# Altium schematic sheet RK3576-SMC.SMARC_1 (0021.0 A0).SchDoc
size 420 x 297 mm; SheetNumber: 1; SheetTotal: 3; Scale: -; DocumentType: Схема электрическая принципиальная; DocumentGOSTLIt1: ㅤ; DocumentGOSTLIt2: ㅤ; DocumentGOSTLIt3: ㅤ; DocumentTypeShort: Э3; DocumentGOSTNote: 1 Элементы, отмеченные *), используются при трассировке печатной платы, в состав модуля не включаются.; DocumentInvertoryNumber: ㅤ
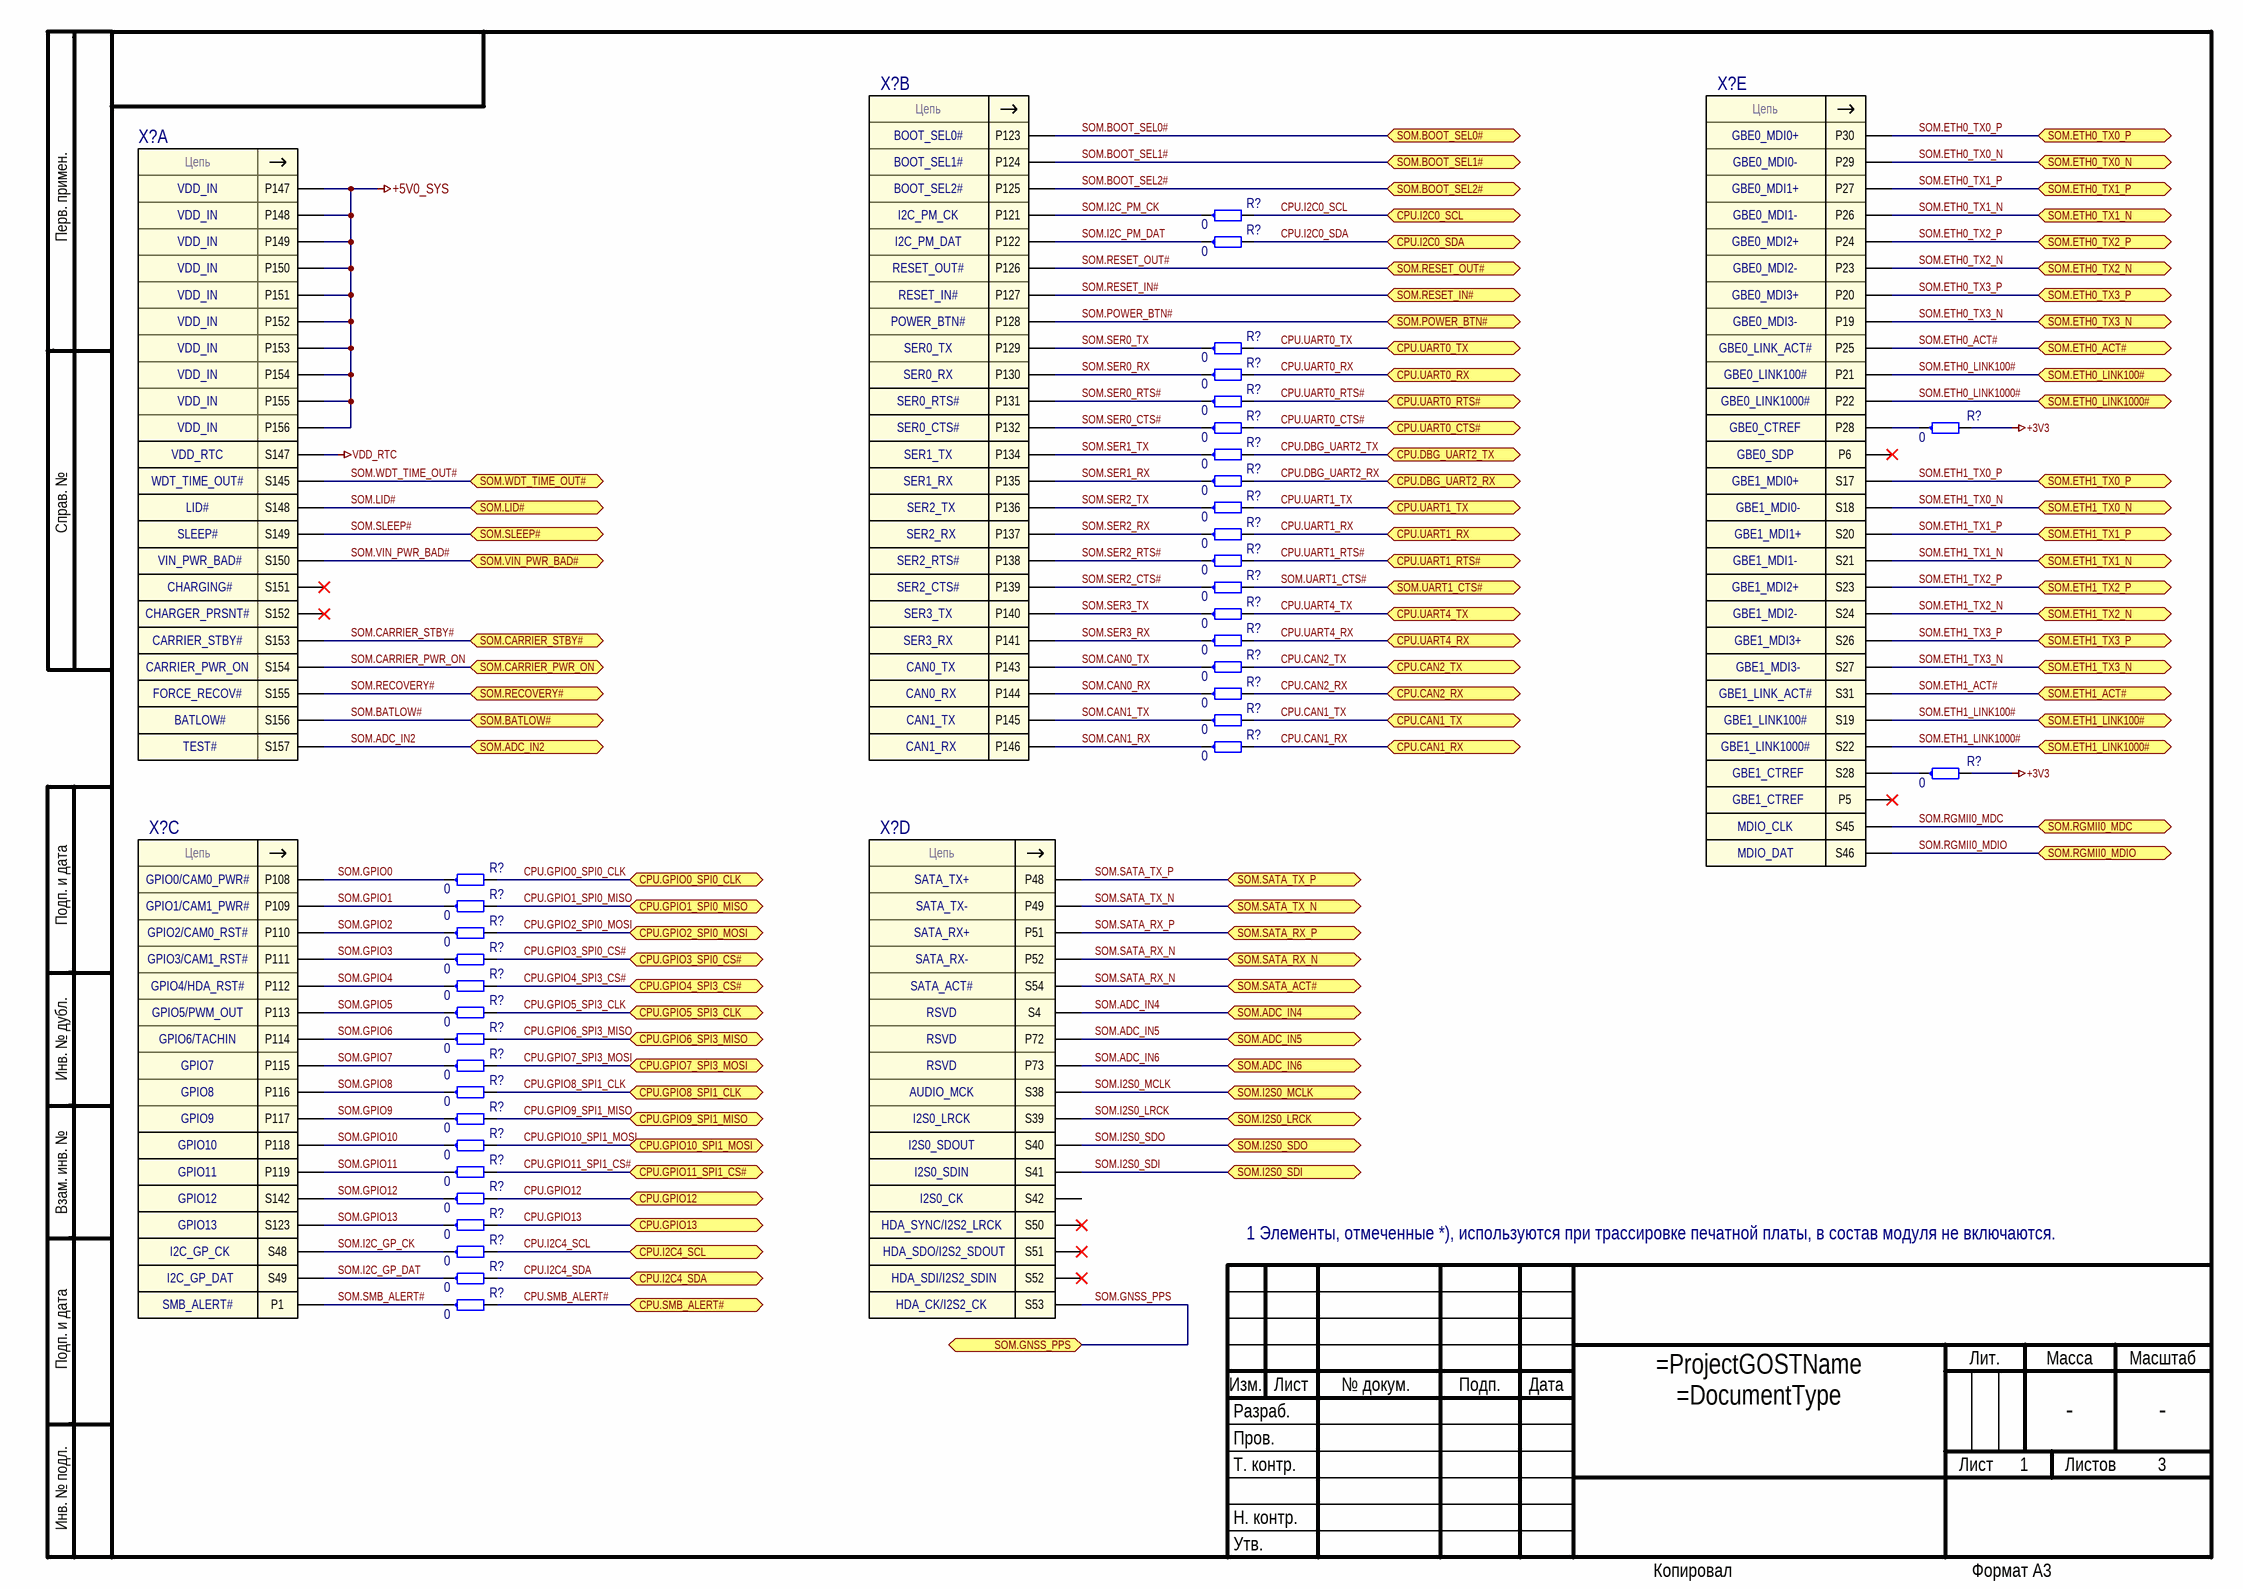
[diagram p0: RK3576-SMC.SMARC_1 (0021.0 A0).SchDoc]

## Parts
(Parts that share a designator on the sheet are numbered #1, #2 ... from top to bottom, then left to right.)
R?#1  0  [resc0603x26n]
R?#2  0  [resc0603x26n]
R?#3  0  [resc0603x26n]
R?#4  0  [resc0603x26n]
R?#5  0  [resc0603x26n]
R?#6  0  [resc0603x26n]
R?#7  0  [resc0603x26n]
R?#8  0  [resc0603x26n]
R?#9  0  [resc0603x26n]
R?#10  0  [resc0603x26n]
R?#11  0  [resc0603x26n]
R?#12  0  [resc0603x26n]
R?#13  0  [resc0603x26n]
R?#14  0  [resc0603x26n]
R?#15  0  [resc0603x26n]
R?#16  0  [resc0603x26n]
R?#17  0  [resc0603x26n]
R?#18  0  [resc0603x26n]
R?#19  0  [resc0603x26n]
R?#20  0  [resc0603x26n]
R?#21  0  [resc0603x26n]
R?#22  0  [resc0603x26n]
R?#23  0  [resc0603x26n]
R?#24  0  [resc0603x26n]
R?#25  0  [resc0603x26n]
R?#26  0  [resc0603x26n]
R?#27  0  [resc0603x26n]
R?#28  0  [resc0603x26n]
R?#29  0  [resc0603x26n]
R?#30  0  [resc0603x26n]
R?#31  0  [resc0603x26n]
R?#32  0  [resc0603x26n]
R?#33  0  [resc0603x26n]
R?#34  0  [resc0603x26n]
R?#35  0  [resc0603x26n]
R?#36  0  [resc0603x26n]
R?#37  0  [resc0603x26n]
X?#1  SMARC  [con_smarc]  (value not drawn)  (part B of 13)
X?#2  SMARC  [con_smarc]  (value not drawn)  (part E of 13)
X?#3  SMARC  [con_smarc]  (value not drawn)  (part A of 13)
X?#4  SMARC  [con_smarc]  (value not drawn)  (part C of 13)
X?#5  SMARC  [con_smarc]  (value not drawn)  (part D of 13)

## Ports
CPU.CAN1_RX (bidir), CPU.CAN1_TX (bidir), CPU.CAN2_RX (bidir), CPU.CAN2_TX (bidir), CPU.DBG_UART2_RX (bidir), CPU.DBG_UART2_TX (bidir), CPU.GPIO0_SPI0_CLK (bidir), CPU.GPIO1_SPI0_MISO (bidir), CPU.GPIO2_SPI0_MOSI (bidir), CPU.GPIO3_SPI0_CS# (bidir), CPU.GPIO4_SPI3_CS# (bidir), CPU.GPIO5_SPI3_CLK (bidir), CPU.GPIO6_SPI3_MISO (bidir), CPU.GPIO7_SPI3_MOSI (bidir), CPU.GPIO8_SPI1_CLK (bidir), CPU.GPIO9_SPI1_MISO (bidir), CPU.GPIO10_SPI1_MOSI (bidir), CPU.GPIO11_SPI1_CS# (bidir), CPU.GPIO12 (bidir), CPU.GPIO13 (bidir), CPU.I2C0_SCL (bidir), CPU.I2C0_SDA (bidir), CPU.I2C4_SCL (bidir), CPU.I2C4_SDA (bidir), CPU.SMB_ALERT# (bidir), CPU.UART0_CTS# (bidir), CPU.UART0_RTS# (bidir), CPU.UART0_RX (bidir), CPU.UART0_TX (bidir), CPU.UART1_RTS# (bidir), CPU.UART1_RX (bidir), CPU.UART1_TX (bidir), CPU.UART4_RX (bidir), CPU.UART4_TX (bidir), SOM.ADC_IN2 (bidir), SOM.ADC_IN4 (bidir), SOM.ADC_IN5 (bidir), SOM.ADC_IN6 (bidir), SOM.BATLOW# (bidir), SOM.BOOT_SEL0# (bidir), SOM.BOOT_SEL1# (bidir), SOM.BOOT_SEL2# (bidir), SOM.CARRIER_PWR_ON (bidir), SOM.CARRIER_STBY# (bidir), SOM.ETH0_ACT# (bidir), SOM.ETH0_LINK100# (bidir), SOM.ETH0_LINK1000# (bidir), SOM.ETH0_TX0_N (bidir), SOM.ETH0_TX0_P (bidir), SOM.ETH0_TX1_N (bidir), SOM.ETH0_TX1_P (bidir), SOM.ETH0_TX2_N (bidir), SOM.ETH0_TX2_P (bidir), SOM.ETH0_TX3_N (bidir), SOM.ETH0_TX3_P (bidir), SOM.ETH1_ACT# (bidir), SOM.ETH1_LINK100# (bidir), SOM.ETH1_LINK1000# (bidir), SOM.ETH1_TX0_N (bidir), SOM.ETH1_TX0_P (bidir), SOM.ETH1_TX1_N (bidir), SOM.ETH1_TX1_P (bidir), SOM.ETH1_TX2_N (bidir), SOM.ETH1_TX2_P (bidir), SOM.ETH1_TX3_N (bidir), SOM.ETH1_TX3_P (bidir), SOM.GNSS_PPS (bidir), SOM.I2S0_LRCK (bidir), SOM.I2S0_MCLK (bidir), SOM.I2S0_SDI (bidir), SOM.I2S0_SDO (bidir), SOM.LID# (bidir), SOM.POWER_BTN# (bidir), SOM.RECOVERY# (bidir), SOM.RESET_IN# (bidir), SOM.RESET_OUT# (bidir), SOM.RGMII0_MDC (bidir), SOM.RGMII0_MDIO (bidir), SOM.SATA_ACT# (bidir), SOM.SATA_RX_N (bidir), SOM.SATA_RX_P (bidir), SOM.SATA_TX_N (bidir), SOM.SATA_TX_P (bidir), SOM.SLEEP# (bidir), SOM.UART1_CTS# (bidir), SOM.VIN_PWR_BAD# (bidir), SOM.WDT_TIME_OUT# (bidir)

## Nets
+3V3: R?#7.2 R?#20.2
+5V0_SYS: X?#3.P147 X?#3.P148 X?#3.P149 X?#3.P150 X?#3.P151 X?#3.P152 X?#3.P153 X?#3.P154 X?#3.P155 X?#3.P156
VDD_RTC: X?#3.S147
CPU.CAN1_RX: R?#19.2 ; port CPU.CAN1_RX
CPU.CAN1_TX: R?#18.2 ; port CPU.CAN1_TX
CPU.CAN2_RX: R?#17.2 ; port CPU.CAN2_RX
CPU.CAN2_TX: R?#16.2 ; port CPU.CAN2_TX
CPU.DBG_UART2_RX: R?#9.2 ; port CPU.DBG_UART2_RX
CPU.DBG_UART2_TX: R?#8.2 ; port CPU.DBG_UART2_TX
CPU.GPIO0_SPI0_CLK: R?#21.2 ; port CPU.GPIO0_SPI0_CLK
CPU.GPIO1_SPI0_MISO: R?#22.2 ; port CPU.GPIO1_SPI0_MISO
CPU.GPIO2_SPI0_MOSI: R?#23.2 ; port CPU.GPIO2_SPI0_MOSI
CPU.GPIO3_SPI0_CS#: R?#24.2 ; port CPU.GPIO3_SPI0_CS#
CPU.GPIO4_SPI3_CS#: R?#25.2 ; port CPU.GPIO4_SPI3_CS#
CPU.GPIO5_SPI3_CLK: R?#26.2 ; port CPU.GPIO5_SPI3_CLK
CPU.GPIO6_SPI3_MISO: R?#27.2 ; port CPU.GPIO6_SPI3_MISO
CPU.GPIO7_SPI3_MOSI: R?#28.2 ; port CPU.GPIO7_SPI3_MOSI
CPU.GPIO8_SPI1_CLK: R?#29.2 ; port CPU.GPIO8_SPI1_CLK
CPU.GPIO9_SPI1_MISO: R?#30.2 ; port CPU.GPIO9_SPI1_MISO
CPU.GPIO10_SPI1_MOSI: R?#31.2 ; port CPU.GPIO10_SPI1_MOSI
CPU.GPIO11_SPI1_CS#: R?#32.2 ; port CPU.GPIO11_SPI1_CS#
CPU.GPIO12: R?#33.2 ; port CPU.GPIO12
CPU.GPIO13: R?#34.2 ; port CPU.GPIO13
CPU.I2C0_SCL: R?#1.2 ; port CPU.I2C0_SCL
CPU.I2C0_SDA: R?#2.2 ; port CPU.I2C0_SDA
CPU.I2C4_SCL: R?#35.2 ; port CPU.I2C4_SCL
CPU.I2C4_SDA: R?#36.2 ; port CPU.I2C4_SDA
CPU.SMB_ALERT#: R?#37.2 ; port CPU.SMB_ALERT#
CPU.UART0_CTS#: R?#6.2 ; port CPU.UART0_CTS#
CPU.UART0_RTS#: R?#5.2 ; port CPU.UART0_RTS#
CPU.UART0_RX: R?#4.2 ; port CPU.UART0_RX
CPU.UART0_TX: R?#3.2 ; port CPU.UART0_TX
CPU.UART1_RTS#: R?#12.2 ; port CPU.UART1_RTS#
CPU.UART1_RX: R?#11.2 ; port CPU.UART1_RX
CPU.UART1_TX: R?#10.2 ; port CPU.UART1_TX
CPU.UART4_RX: R?#15.2 ; port CPU.UART4_RX
CPU.UART4_TX: R?#14.2 ; port CPU.UART4_TX
SOM.ADC_IN2: X?#3.S157 ; port SOM.ADC_IN2
SOM.ADC_IN4: X?#5.S4 ; port SOM.ADC_IN4
SOM.ADC_IN5: X?#5.P72 ; port SOM.ADC_IN5
SOM.ADC_IN6: X?#5.P73 ; port SOM.ADC_IN6
SOM.BATLOW#: X?#3.S156 ; port SOM.BATLOW#
SOM.BOOT_SEL0#: X?#1.P123 ; port SOM.BOOT_SEL0#
SOM.BOOT_SEL1#: X?#1.P124 ; port SOM.BOOT_SEL1#
SOM.BOOT_SEL2#: X?#1.P125 ; port SOM.BOOT_SEL2#
SOM.CAN0_RX: R?#17.1 X?#1.P144
SOM.CAN0_TX: R?#16.1 X?#1.P143
SOM.CAN1_RX: R?#19.1 X?#1.P146
SOM.CAN1_TX: R?#18.1 X?#1.P145
SOM.CARRIER_PWR_ON: X?#3.S154 ; port SOM.CARRIER_PWR_ON
SOM.CARRIER_STBY#: X?#3.S153 ; port SOM.CARRIER_STBY#
SOM.ETH0_ACT#: X?#2.P25 ; port SOM.ETH0_ACT#
SOM.ETH0_LINK100#: X?#2.P21 ; port SOM.ETH0_LINK100#
SOM.ETH0_LINK1000#: X?#2.P22 ; port SOM.ETH0_LINK1000#
SOM.ETH0_TX0_N: X?#2.P29 ; port SOM.ETH0_TX0_N
SOM.ETH0_TX0_P: X?#2.P30 ; port SOM.ETH0_TX0_P
SOM.ETH0_TX1_N: X?#2.P26 ; port SOM.ETH0_TX1_N
SOM.ETH0_TX1_P: X?#2.P27 ; port SOM.ETH0_TX1_P
SOM.ETH0_TX2_N: X?#2.P23 ; port SOM.ETH0_TX2_N
SOM.ETH0_TX2_P: X?#2.P24 ; port SOM.ETH0_TX2_P
SOM.ETH0_TX3_N: X?#2.P19 ; port SOM.ETH0_TX3_N
SOM.ETH0_TX3_P: X?#2.P20 ; port SOM.ETH0_TX3_P
SOM.ETH1_ACT#: X?#2.S31 ; port SOM.ETH1_ACT#
SOM.ETH1_LINK100#: X?#2.S19 ; port SOM.ETH1_LINK100#
SOM.ETH1_LINK1000#: X?#2.S22 ; port SOM.ETH1_LINK1000#
SOM.ETH1_TX0_N: X?#2.S18 ; port SOM.ETH1_TX0_N
SOM.ETH1_TX0_P: X?#2.S17 ; port SOM.ETH1_TX0_P
SOM.ETH1_TX1_N: X?#2.S21 ; port SOM.ETH1_TX1_N
SOM.ETH1_TX1_P: X?#2.S20 ; port SOM.ETH1_TX1_P
SOM.ETH1_TX2_N: X?#2.S24 ; port SOM.ETH1_TX2_N
SOM.ETH1_TX2_P: X?#2.S23 ; port SOM.ETH1_TX2_P
SOM.ETH1_TX3_N: X?#2.S27 ; port SOM.ETH1_TX3_N
SOM.ETH1_TX3_P: X?#2.S26 ; port SOM.ETH1_TX3_P
SOM.GNSS_PPS: X?#5.S53 ; port SOM.GNSS_PPS
SOM.GPIO0: R?#21.1 X?#4.P108
SOM.GPIO1: R?#22.1 X?#4.P109
SOM.GPIO2: R?#23.1 X?#4.P110
SOM.GPIO3: R?#24.1 X?#4.P111
SOM.GPIO4: R?#25.1 X?#4.P112
SOM.GPIO5: R?#26.1 X?#4.P113
SOM.GPIO6: R?#27.1 X?#4.P114
SOM.GPIO7: R?#28.1 X?#4.P115
SOM.GPIO8: R?#29.1 X?#4.P116
SOM.GPIO9: R?#30.1 X?#4.P117
SOM.GPIO10: R?#31.1 X?#4.P118
SOM.GPIO11: R?#32.1 X?#4.P119
SOM.GPIO12: R?#33.1 X?#4.S142
SOM.GPIO13: R?#34.1 X?#4.S123
SOM.I2C_GP_CK: R?#35.1 X?#4.S48
SOM.I2C_GP_DAT: R?#36.1 X?#4.S49
SOM.I2C_PM_CK: R?#1.1 X?#1.P121
SOM.I2C_PM_DAT: R?#2.1 X?#1.P122
SOM.I2S0_LRCK: X?#5.S39 ; port SOM.I2S0_LRCK
SOM.I2S0_MCLK: X?#5.S38 ; port SOM.I2S0_MCLK
SOM.I2S0_SDI: X?#5.S41 ; port SOM.I2S0_SDI
SOM.I2S0_SDO: X?#5.S40 ; port SOM.I2S0_SDO
SOM.LID#: X?#3.S148 ; port SOM.LID#
SOM.POWER_BTN#: X?#1.P128 ; port SOM.POWER_BTN#
SOM.RECOVERY#: X?#3.S155 ; port SOM.RECOVERY#
SOM.RESET_IN#: X?#1.P127 ; port SOM.RESET_IN#
SOM.RESET_OUT#: X?#1.P126 ; port SOM.RESET_OUT#
SOM.RGMII0_MDC: X?#2.S45 ; port SOM.RGMII0_MDC
SOM.RGMII0_MDIO: X?#2.S46 ; port SOM.RGMII0_MDIO
SOM.SATA_RX_N: X?#5.P52 X?#5.S54 ; port SOM.SATA_RX_N, port SOM.SATA_ACT#
SOM.SATA_RX_P: X?#5.P51 ; port SOM.SATA_RX_P
SOM.SATA_TX_N: X?#5.P49 ; port SOM.SATA_TX_N
SOM.SATA_TX_P: X?#5.P48 ; port SOM.SATA_TX_P
SOM.SER0_CTS#: R?#6.1 X?#1.P132
SOM.SER0_RTS#: R?#5.1 X?#1.P131
SOM.SER0_RX: R?#4.1 X?#1.P130
SOM.SER0_TX: R?#3.1 X?#1.P129
SOM.SER1_RX: R?#9.1 X?#1.P135
SOM.SER1_TX: R?#8.1 X?#1.P134
SOM.SER2_CTS#: R?#13.1 X?#1.P139
SOM.SER2_RTS#: R?#12.1 X?#1.P138
SOM.SER2_RX: R?#11.1 X?#1.P137
SOM.SER2_TX: R?#10.1 X?#1.P136
SOM.SER3_RX: R?#15.1 X?#1.P141
SOM.SER3_TX: R?#14.1 X?#1.P140
SOM.SLEEP#: X?#3.S149 ; port SOM.SLEEP#
SOM.SMB_ALERT#: R?#37.1 X?#4.P1
SOM.UART1_CTS#: R?#13.2 ; port SOM.UART1_CTS#
SOM.VIN_PWR_BAD#: X?#3.S150 ; port SOM.VIN_PWR_BAD#
SOM.WDT_TIME_OUT#: X?#3.S145 ; port SOM.WDT_TIME_OUT#
NetR?#7_1: R?#7.1 X?#2.P28
NetR?#20_1: R?#20.1 X?#2.S28

Not connected (* = marked no-connect by the designer): X?#2 P5* P6*; X?#3 S151* S152*; X?#5 S42 S50* S51* S52*

## Notes on the sheet
- Перв. примен.
- Справ. №
- Подп. и дата
- Инв. № дубл.
- Взам. инв. №
- Разраб.
- Изм.
- Лист
- № докум.
- Подп.
- Дата
- Лит.
- Масса
- Масштаб
- Пров.
- Т. контр.
- -
- Листов
- Инв. № подл.
- Утв.
- Н. контр.
- Копировал
- Формат А3
- (in symbol SMARC, part A) Цепь; VDD_IN; VDD_RTC; WDT_TIME_OUT#; LID#; SLEEP#; VIN_PWR_BAD#; CHARGING#; CHARGER_PRSNT#; CARRIER_STBY#; CARRIER_PWR_ON; FORCE_RECOV#; BATLOW#; TEST#
- (in symbol SMARC, part B) Цепь; BOOT_SEL0#; BOOT_SEL1#; BOOT_SEL2#; I2C_PM_CK; I2C_PM_DAT; RESET_OUT#; RESET_IN#; POWER_BTN#; SER0_TX; SER0_RX; SER0_RTS#; SER0_CTS#; SER1_TX; SER1_RX; SER2_TX; SER2_RX; SER2_RTS#; SER2_CTS#; SER3_TX; SER3_RX; CAN0_TX; CAN0_RX; CAN1_TX; CAN1_RX
- (in symbol SMARC, part C) Цепь; GPIO0/CAM0_PWR#; GPIO1/CAM1_PWR#; GPIO2/CAM0_RST#; GPIO3/CAM1_RST#; GPIO4/HDA_RST#; GPIO5/PWM_OUT; GPIO6/TACHIN; GPIO7; GPIO8; GPIO9; GPIO10; GPIO11; GPIO12; GPIO13; I2C_GP_CK; I2C_GP_DAT; SMB_ALERT#
- (in symbol SMARC, part D) Цепь; SATA_TX+; SATA_TX-; SATA_RX+; SATA_RX-; SATA_ACT#; RSVD; AUDIO_MCK; I2S0_LRCK; I2S0_SDOUT; I2S0_SDIN; I2S0_CK; HDA_SYNC/I2S2_LRCK; HDA_SDO/I2S2_SDOUT; HDA_SDI/I2S2_SDIN; HDA_CK/I2S2_CK
- (in symbol SMARC, part E) Цепь; GBE0_MDI0+; GBE0_MDI0-; GBE0_MDI1+; GBE0_MDI1-; GBE0_MDI2+; GBE0_MDI2-; GBE0_MDI3+; GBE0_MDI3-; GBE0_LINK_ACT#; GBE0_LINK100#; GBE0_LINK1000#; GBE0_CTREF; GBE0_SDP; GBE1_MDI0+; GBE1_MDI0-; GBE1_MDI1+; GBE1_MDI1-; GBE1_MDI2+; GBE1_MDI2-; GBE1_MDI3+; GBE1_MDI3-; GBE1_LINK_ACT#; GBE1_LINK100#; GBE1_LINK1000#; GBE1_CTREF; MDIO_CLK; MDIO_DAT

## Library data of the parts
R?#1-R?#37 = RC0201JR-070RL: Резисторы (chip) общего назначения; Part_ID: ATB-09733; Manufacturer: Yageo; Schematic_Part: R_min_val,R_min,R_val,R; Наименование: 0201-0.05W-0±5%; Voltage: 30V; Power: 0.05; Точность: ±5%; Температура: -55 +125; Вариант установки: Поверхностный; Код ERP: E2-00008416; Photo: Photos\Photos\Yageo_RC0075-RC2512.jpg; Автор: Чепиков И.В.; Device: 0201-0.05W-0±5%_Yageo; Library Ref 2: R; Part Number: RC0201JR-070RL; Тип ЭКБ: Резисторы; Datasheet: Datasheets\Resistors\PYu-RC_Group_51_RoHS_L_12.pdf; Тип компонента: Резистор; Номинал: 0; Value: 0; Part_Number: RC0201JR-070RL; PCB_Footprint: resc0603x26n; Тип корпуса: Chip; Height: 0.26; Производитель: Yageo; Website: https://www.yageo.com/upload/media/product/products/datasheet/rchip/PYu-RC_Group_51_RoHS_L_12.pdf; Дата: 14.01.2025; NameFromManufacturer: RC0201JR-070RL; ComponentLink1URL: https://www.yageo.com/upload/media/product/products/datasheet/rchip/PYu-RC_Group_51_RoHS_L_12.pdf; ComponentLink1Description: PYu-RC_Group_51_RoHS_L_12.pdf; Original PN: RC0201JR-070RL
X?#1-X?#5 = SMARC: Краевой разъем SMARC_V21, 314 конт.; Part_ID: ATB-00378; Manufacturer: SMARC 2.1 Specification; Тип ЭКБ: Соединители; Тип компонента: Вилка Краевой Smarc; Photo: Photos\Photos\SMARC.jpg; Автор: Чепиков И.В.; Part Number: SMARC; Наименование: SMARC; Datasheet: Datasheets\Connectors\SMARC_V21-specification.pdf; Schematic_Part: SMARC_v2_1_XP; Value: SMARC; Part_Number: SMARC; PCB_Footprint: con_smarc; Website: https://www.isee.biz/images/Manuals/smarc/SMARC_Hardware_Specification_V211.pdf; Дата: 01.07.2024; Device: SMARC; NameFromManufacturer: SMARC; ComponentLink1URL: https://www.isee.biz/images/Manuals/smarc/SMARC_Hardware_Specification_V211.pdf; ComponentLink1Description: SMARC_V21-specification.pdf; Original PN: SMARC